# EasyEDA Pro project 搞机小队_v1.1.3.eprj, schematic 机身
Board Name: 机身; Create Date: 2025-09-06; Page Name: P1; Project Name: 搞机小队_v1.1.3; Schematic Name: 机身; Update Date: 2025-10-28; Company: 嘉立创EDA; Page Size: A4; Version: V1.0
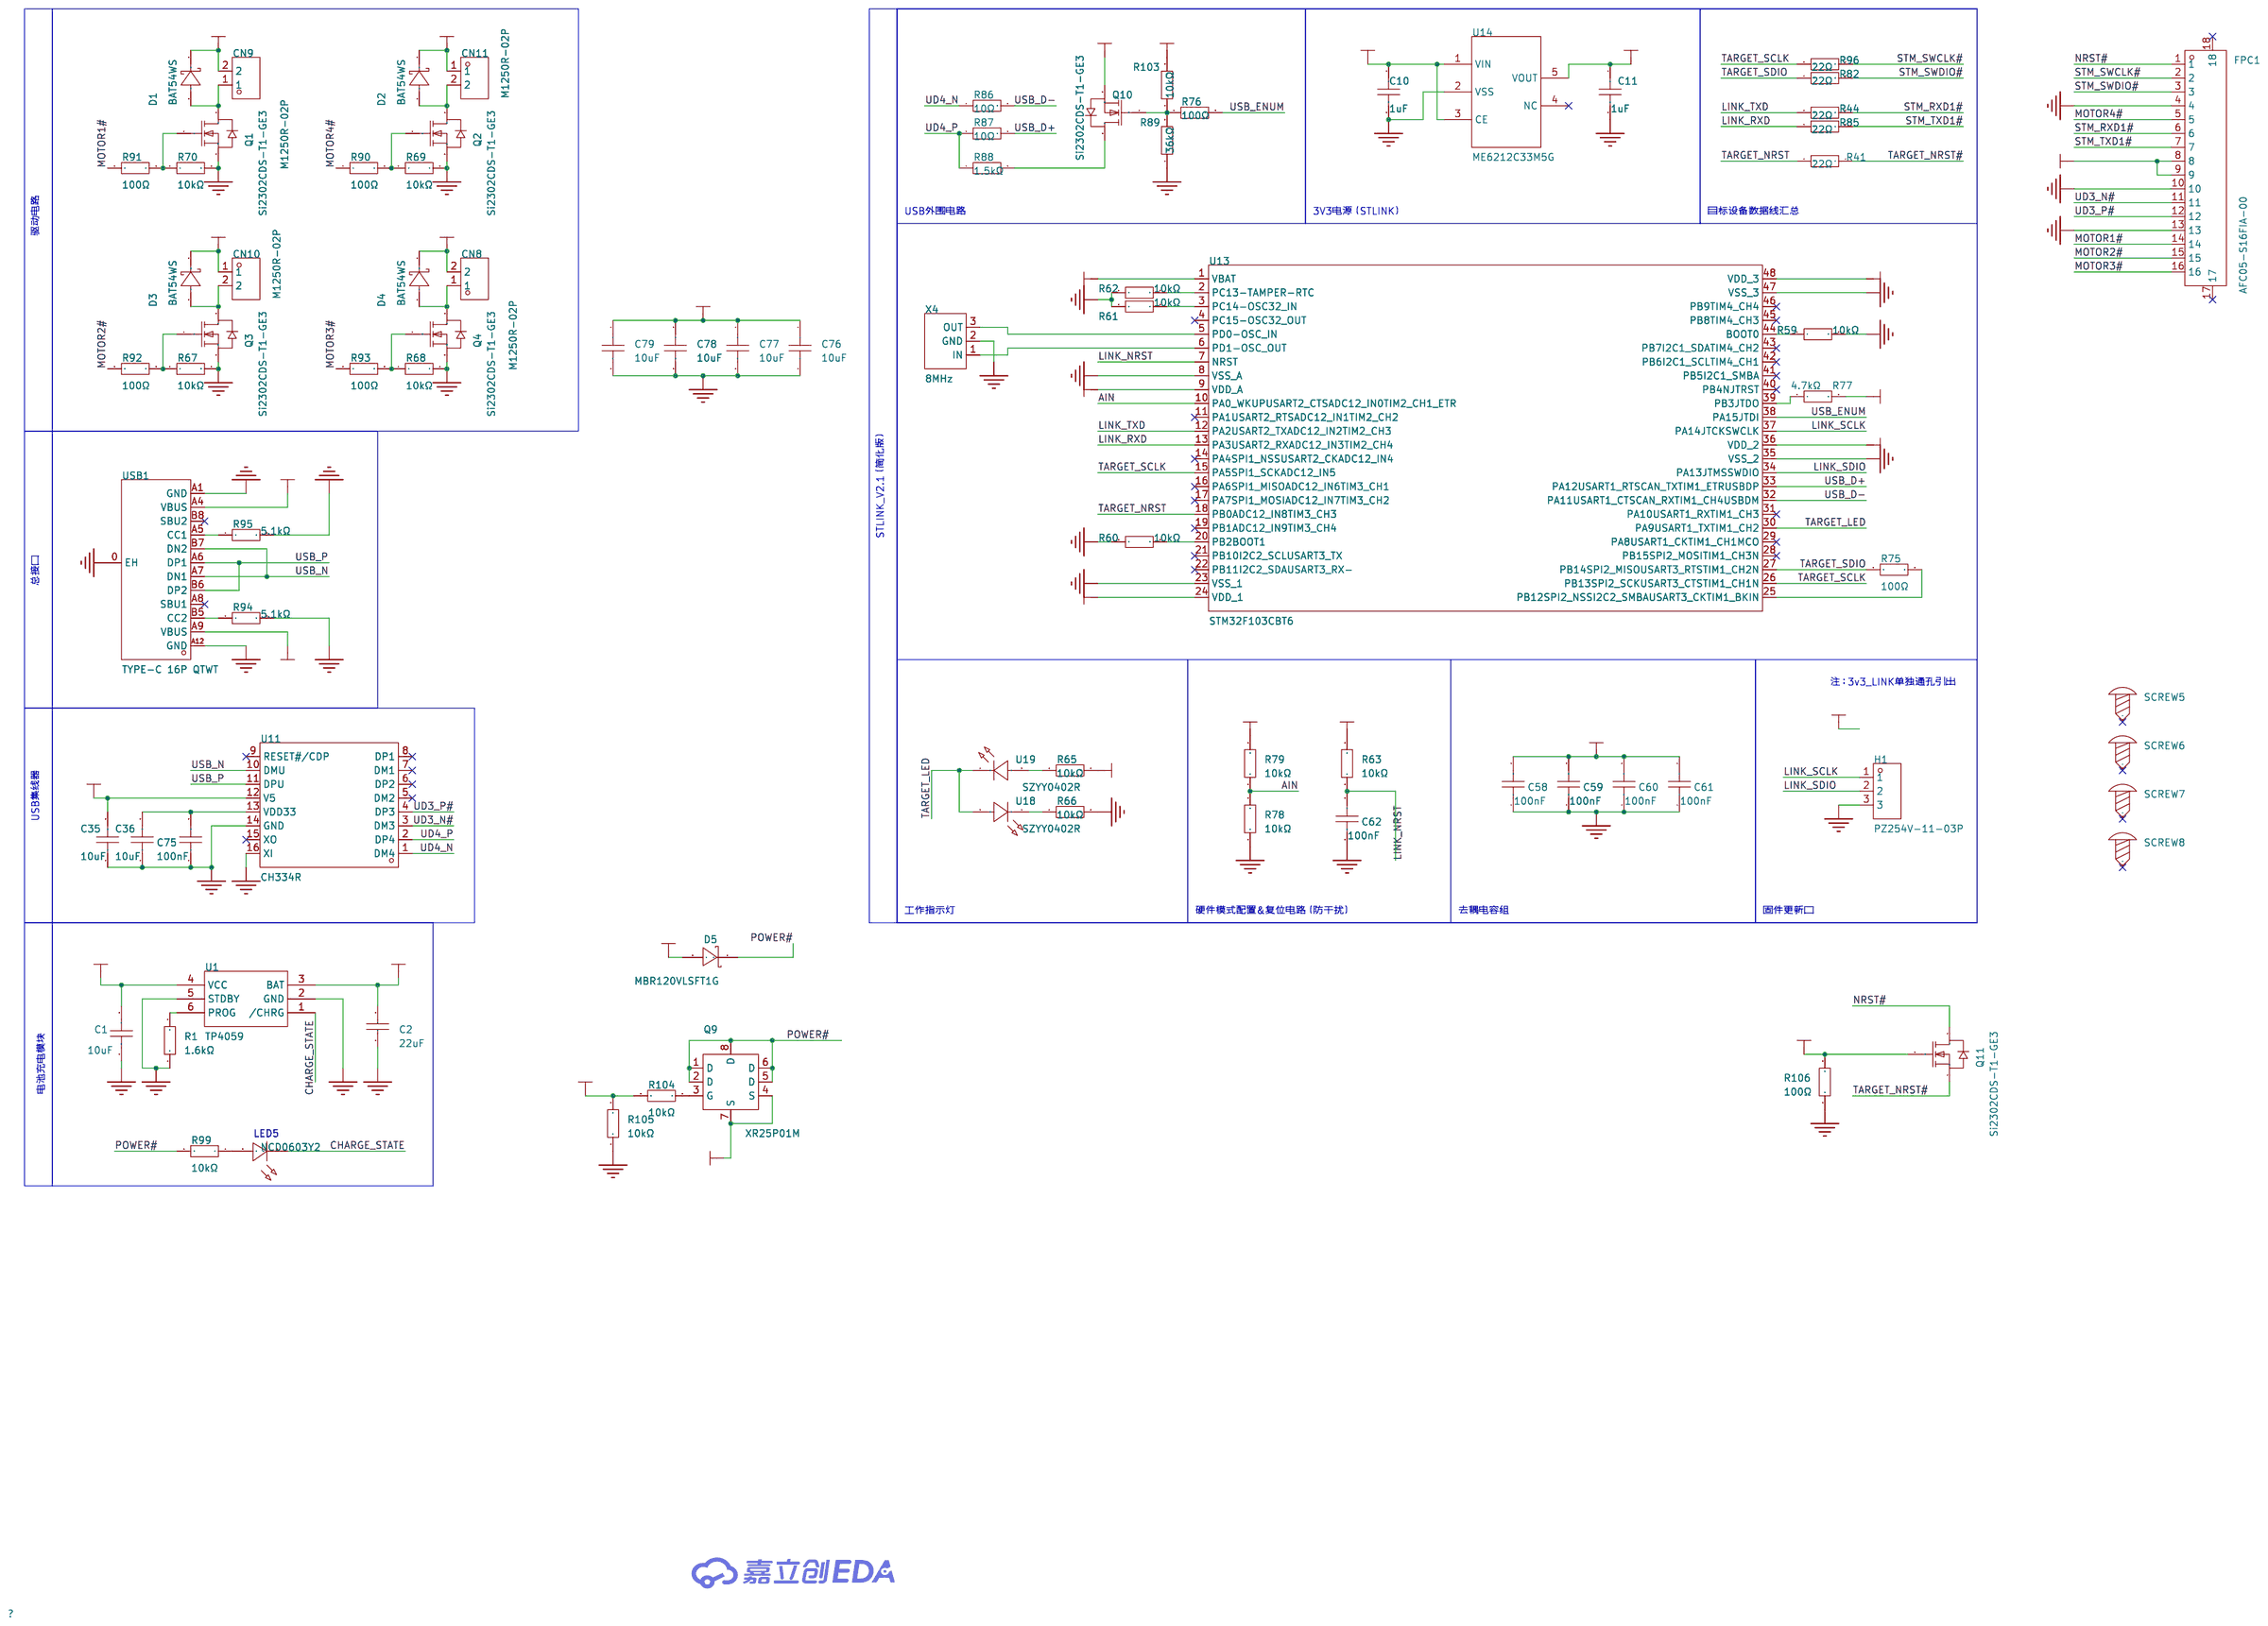
[diagram p1: schematic sheet]

## Parts
C1  10uF  [C0603]
C2  22uF  [C0603]
C10  1uF  [C0603]
C11  1uF  [C0603]
C35  10uF  [C0603]
C36  10uF  [C0603]
C58  100nF  [C0402]
C59  100nF  [C0402]
C60  100nF  [C0402]
C61  100nF  [C0402]
C62  100nF  [C0402]
C75  100nF  [C0402]
C76  10uF  [C0805]
C77  10uF  [C0805]
C78  10uF  [C0805]
C79  10uF  [C0805]
CN8  M1250R-02P  [CONN-TH_2P-P1.25_L4.7-W4.3]
CN9  M1250R-02P  [CONN-TH_2P-P1.25_L4.7-W4.3]
CN10  M1250R-02P  [CONN-TH_2P-P1.25_L4.7-W4.3]
CN11  M1250R-02P  [CONN-TH_2P-P1.25_L4.7-W4.3]
D1  BAT54WS  [SOD-323_L1.7-W1.3-LS2.6-RD]
D2  BAT54WS  [SOD-323_L1.7-W1.3-LS2.6-RD]
D3  BAT54WS  [SOD-323_L1.7-W1.3-LS2.6-RD]
D4  BAT54WS  [SOD-323_L1.7-W1.3-LS2.6-RD]
D5  MBR120VLSFT1G  [SOD-123F_L2.8-W1.8-LS3.7-RD]
FPC1  AFC05-S16FIA-00  [FPC-SMD_16P-P0.50_AFC05-S16FIA-00]
H1  PZ254V-11-03P  [HDR-TH_3P-P2.54-V-M]
LED5  NCD0603Y2  [LED0603-RD]
Q1  Si2302CDS-T1-GE3  [SOT-23_L2.9-W1.3-P1.90-LS2.4-BR]
Q2  Si2302CDS-T1-GE3  [SOT-23_L2.9-W1.3-P1.90-LS2.4-BR]
Q3  Si2302CDS-T1-GE3  [SOT-23_L2.9-W1.3-P1.90-LS2.4-BR]
Q4  Si2302CDS-T1-GE3  [SOT-23_L2.9-W1.3-P1.90-LS2.4-BR]
Q9  XR25P01M  [DFN-6L_L2.0-W2.0-P0.65-BL]
Q10  Si2302CDS-T1-GE3  [SOT-23_L2.9-W1.3-P1.90-LS2.4-BR]
Q11  Si2302CDS-T1-GE3  [SOT-23_L2.9-W1.3-P1.90-LS2.4-BR]
R1  1.6kΩ  [R0402]
R41  22Ω  [R0603]
R44  22Ω  [R0603]
R59  10kΩ  [R0402]
R60  10kΩ  [R0402]
R61  10kΩ  [R0402]
R62  10kΩ  [R0402]
R63  10kΩ  [R0402]
R65  10kΩ  [R0402]
R66  10kΩ  [R0402]
R67  10kΩ  [R0402]
R68  10kΩ  [R0402]
R69  10kΩ  [R0402]
R70  10kΩ  [R0402]
R75  100Ω  [R0402]
R76  100Ω  [R0402]
R77  4.7kΩ  [R0402]
R78  10kΩ  [R0402]
R79  10kΩ  [R0402]
R82  22Ω  [R0402]
R85  22Ω  [R0402]
R86  10Ω  [R0402]
R87  10Ω  [R0402]
R88  1.5kΩ  [R0402]
R89  36kΩ  [R0402]
R90  100Ω  [R0402]
R91  100Ω  [R0402]
R92  100Ω  [R0402]
R93  100Ω  [R0402]
R94  5.1kΩ  [R0402]
R95  5.1kΩ  [R0402]
R96  22Ω  [R0603]
R99  10kΩ  [R0402]
R103  10kΩ  [R0805]
R104  10kΩ  [R0402]
R105  10kΩ  [R0402]
R106  100Ω  [R0402]
SCREW5  -  [M2螺丝]
SCREW6  -  [M2螺丝]
SCREW7  -  [M2螺丝]
SCREW8  -  [M2螺丝]
U1  TP4059  [SOT-23-6_L2.9-W1.6-P0.95-LS2.8-BR]
U11  CH334R  [QSOP-16_L4.9-W3.9-P0.64-LS6.0-BL]
U13  STM32F103CBT6  [LQFP-48_L7.0-W7.0-P0.50-LS9.0-BL]
U14  ME6212C33M5G  [SOT-23-5_L3.0-W1.7-P0.95-LS2.8-BL]
U18  SZYY0402R  [LED0402-RD_RED]
U19  SZYY0402R  [LED0402-RD_RED]
USB1  TYPE-C 16P QTWT  [USB-TYPE-C-SMD_TYPE-C-16P-QTWT]
X4  8MHz  [OSC-SMD_3P-L3.2-W1.3-P1.20]

## Library data of the parts
C1 C35 C36 = CC0603KRX5R6BB106: 容值:10uF;精度:±10%;额定电压:10V;材质(温度系数):X5R;; LCSC Part Name: 10uF ±10% 10V; Supplier Part: C326057; Manufacturer: YAGEO(国巨); Supplier Footprint: 0603; JLCPCB Part Class: 扩展库; Datasheet: https://atta.szlcsc.com/upload/public/pdf/source/20181031/C326057_4190003E428C5A97DF6434D0EAB53BEA.pdf; Supplier: LCSC; Tolerance: ±10%; Voltage Rated: 10V; Temperature Coefficient: X5R
C2 = CC0603MRX5R6BB226: 容值:22uF;精度:±20%;额定电压:10V;温度系数:X5R;; LCSC Part Name: 22uF ±20% 10V; Supplier Part: C109447; Manufacturer: YAGEO(国巨); Supplier Footprint: 0603; JLCPCB Part Class: Extended Part; Datasheet: https://item.szlcsc.com/datasheet/CC0603MRX5R6BB226/110668.html; Supplier: LCSC; Tolerance: ±20%; Voltage Rated: 10V; Temperature Coefficient: X5R; Voltage Rating: 10V
C10 C11 = CC0603KRX7R7BB105: LCSC Part Name: 1uF ±10% 16V; Supplier Part: C106248; Manufacturer: YAGEO(国巨); Supplier Footprint: 0603; JLCPCB Part Class: Extended Part; Datasheet: https://item.szlcsc.com/datasheet/CC0603KRX7R7BB105/107463.html; Supplier: LCSC; Tolerance: ±10%; Voltage Rating: 16V; Temperature Coefficient: X7R
C58-C62 C75 = CC0402KRX7R7BB104: 容值:100nF;精度:±10%;额定电压:16V;材质(温度系数):X7R;; LCSC Part Name: 100nF ±10% 16V; Supplier Part: C60474; Manufacturer: YAGEO(国巨); Supplier Footprint: 0402; Datasheet: https://atta.szlcsc.com/upload/public/pdf/source/20211223/9278FD768280B81DDBEF48FA36411A03.pdf; Supplier: LCSC; Tolerance: ±10%; Voltage Rated: 16V; Temperature Coefficient: X7R
C76-C79 = CC0805KKX7R6BB106: 容值:10uF;精度:±10%;额定电压:10V;温度系数:X7R;; LCSC Part Name: 10uF ±10% 10V; Supplier Part: C1952580; Manufacturer: YAGEO(国巨); Supplier Footprint: 0805; JLCPCB Part Class: 扩展库; Datasheet: https://item.szlcsc.com/datasheet/CC0805KKX7R6BB106/2044114.html; Supplier: LCSC; Tolerance: ±10%; Voltage Rating: 10V; Temperature Coefficient: X7R
CN8-CN11 = M1250R-02P: 插针结构:1x2P;间距:1.25mm;安装方式:弯插;参考系列:-;总PIN数:2P;排数:1;每排PIN数:2;行距:-;额定电流:1A;工作温度范围:-25℃~+85℃;; LCSC Part Name: 1x2P 间距:1.25mm 弯插; Supplier Part: C481436; Manufacturer: XFCN(兴飞); Supplier Footprint: 弯插,P=1.25mm; Datasheet: https://atta.szlcsc.com/upload/public/pdf/source/20200107/C481438_2614F4E1D71DF19BF060E3C7AF9821C4.pdf; Supplier: LCSC; Pins Structure: 1x2P; Pitch: 1.25mm; Mounting Style: 弯插; Number of Pins: 2P; Number of Rows: 1; Number of PINs Per Row: 2; Current Rating (Max): 1A; Operating Temperature Range: -25℃~+85℃
D1-D4 = BAT54WS_C5766570: 这款肖特基二极管具有0.2A的额定电流和30V的最大电压，其低正向压降仅为0.8V，在轻负载条件下反向电流低至2µA。该二极管能够承受高达0.6A的瞬态浪涌电流，适用于各种便携式电子产品中的高效整流或保护电路，确保设备稳定运行的同时减少能量损耗。(BAT54WS-7-F); LCSC Part Name: IF:0.2A VR:30V VF:0.8V IFSM:0.6A; Supplier Part: C5766570; Manufacturer: HXY MOSFET(华轩阳电子); Supplier Footprint: SOD-323; JLCPCB Part Class: 扩展库; Datasheet: https://atta.szlcsc.com/upload/public/pdf/source/20240930/6373992D0165080641439F83871EFB7A.pdf; Supplier: LCSC
D5 = MBR120VLSFT1G: 正向压降(Vf):300mV@1A;直流反向耐压(Vr):20V;整流电流:1A;; LCSC Part Name: 电压:20V 电流:1A; Supplier Part: C223608; Manufacturer: onsemi(安森美); Supplier Footprint: SOD-123FL; JLCPCB Part Class: 扩展库; Datasheet: https://item.szlcsc.com/datasheet/MBR120VLSFT1G/223798.html; Supplier: LCSC; Voltage - Forward(Vf@If): 300mV@1A; Voltage - DC Reverse(Vr): 20V; Current - Rectified: 1A; Reverse Leakage Current (Ir): 600uA@20V; Operating Junction Temperature Range: -65℃~+125℃; Non-Repetitive Peak Forward Surge Current: 45A
FPC1 = AFC05-S16FIA-00: 锁定特性:翻盖式;触点类型:下接;触点数量:16P;间距:0.5mm;安装方式:卧贴;; LCSC Part Name: 间距:0.5mm P数:16P 翻盖式 下接; Supplier Part: C561388; Manufacturer: JS(钜硕电子); Supplier Footprint: SMD,P=0.5mm,卧贴; Datasheet: https://item.szlcsc.com/datasheet/AFC05-S16FIA-00/586775.html; Supplier: LCSC; Locking Feature: 翻盖式; Contact Type: 下接; Number of Contacts: 16P; Pitch: 0.5mm; Mounting Type: 卧贴; FFC, FCB Thickness: 0.3mm; Height Above Board: 1mm
H1 = PZ254V-11-03P: LCSC Part Name: 1x3P 间距:2.54mm 方针 直插; Supplier Part: C2937625; Manufacturer: XFCN(兴飞); Supplier Footprint: 插件,P=2.54mm; JLCPCB Part Class: Extended Part; Datasheet: https://item.szlcsc.com/datasheet/PZ254V-11-03P/3293280.html; Supplier: LCSC; Pin Structure: 1x3P; Pitch: 2.54mm; Circluar Pins/Square Pins: 方针; Mounting Type: 直插; Number of Rows: 单排; Number of Pins: 3P; Current Rating: 3A; Voltage Rating (Max): 250V; Length of Mating Pin: 6mm; Insulation Height: 2.5mm; Length of End Connection Pin: 3mm; Operating Temperature: -40℃~+105℃; Color: 黑色
LED5 = NCD0603Y2: Supplier Part: C89811; Manufacturer: 国星光电; Supplier Footprint: 0603; JLCPCB Part Class: Extended Part; Datasheet: https://atta.szlcsc.com/upload/public/pdf/source/20200820/C89811_7FE84B429B6BCA3E113B125EE1452576.pdf; Supplier: LCSC; Emitted Color: 黄色; Forward Voltage (VF): 1.6V~2.6V; Power Dissipation: 65mW; Forward Current: 20mA; Dominant Wavelength: 586nm~595nm; Lens Color: 无色透明透镜; Luminous Intensity: 100mcd~220mcd; Viewing Angle: 130°; Operating Temperature: -30℃~+85℃
Q1-Q4 Q10 Q11 = Si2302CDS-T1-GE3: 类型:1个N沟道;漏源电压(Vdss):20V;连续漏极电流(Id):2.9A;导通电阻(RDS(on)@Vgs,Id):57mΩ@4.5V,3.6A;功率(Pd):550mW;阈值电压(Vgs(th)@Id):850mV@250uA;; LCSC Part Name: 1个N沟道 耐压:20V 电流:2.9A; Supplier Part: C10488; Manufacturer: VISHAY(威世); Supplier Footprint: SOT-23; JLCPCB Part Class: 扩展库; Datasheet: https://atta.szlcsc.com/upload/public/pdf/source/20121215/1457706570095.pdf; Supplier: LCSC; Type: 1个N沟道; Drain Source Voltage (Vdss): 20V; Continuous Drain Current (Id): 2.9A; Drain Source On Resistance (RDS(on)@Vgs,Id): 57mΩ@4.5V,3.6A; Power Dissipation (Pd): 550mW; Gate Threshold Voltage (Vgs(th)@Id): 850mV@250uA; Total Gate Charge (Qg@Vgs): 3.5nC@4.5V; Input Capacitance (Ciss@Vds): 320pF@10V; Reverse Transfer Capacitance (Crss@Vds): 5pF@10V; Operating Temperature: -55℃~+150℃
Q9 = XR25P01M: LCSC Part Name: P沟道15V快速开关MOSFET; Supplier Part: C42456887; Manufacturer: XNRUSEMI(新锐); Supplier Footprint: DFN2020-6L; Datasheet: https://item.szlcsc.com/datasheet/XR25P01M/44527977.html; Supplier: LCSC; Number: 1个P沟道; Drain to Source Voltage: 15V; Current - Continuous Drain(Id): 25A; RDS(on): 9mΩ@4.5V; Pd - Power Dissipation: 18W; Gate Threshold Voltage (Vgs(th)): 1V@250uA; Gate Charge(Qg): 35nC@4.5V; Input Capacitance(Ciss): 2.8nF; Reverse Transfer Capacitance (Crss@Vds): 590pF; Operating Temperature: -55℃~+150℃; Type: P沟道; Output Capacitance(Coss): 690pF
R1 = 0402WGF1601TCE: 电阻类型:厚膜电阻;阻值:1.6kΩ;精度:±1%;功率:62.5mW;最大工作电压:50V;温度系数:±100ppm/℃;; LCSC Part Name: 1.6kΩ ±1% 62.5mW 厚膜电阻; Supplier Part: C4908; Manufacturer: UNI-ROYAL(厚声); Supplier Footprint: 0402; Datasheet: https://atta.szlcsc.com/upload/public/pdf/source/20200306/C422600_1E6D84923E4A46A82E41ADD87F860B5C.pdf; Supplier: LCSC; Type: 厚膜电阻; Tolerance: ±1%; Power(Watts): 62.5mW; Overload Voltage (Max): 50V; Temperature Coefficient: ±100ppm/℃; Operating Temperature Range: -55℃~+155℃
R41 R44 R96 = 0603WAF220JT5E: LCSC Part Name: 22Ω ±1% 100mW 厚膜电阻; Supplier Part: C23345; Manufacturer: UNI-ROYAL(厚声); Supplier Footprint: 0603; JLCPCB Part Class: Basic Part; Datasheet: https://atta.szlcsc.com/upload/public/pdf/source/20200306/C422600_1E6D84923E4A46A82E41ADD87F860B5C.pdf; Supplier: LCSC; Type: 厚膜电阻; Tolerance: ±1%; Power(Watts): 100mW; Overload Voltage (Max): 75V; Temperature Coefficient: ±100ppm/℃; Operating Temperature Range: -55℃~+155℃
R59-R63 R65-R70 R78 R79 R99 R104 R105 = 0402WGF1002TCE: 电阻类型:厚膜电阻;阻值:10kΩ;精度:±1%;功率:62.5mW;工作电压:50V;温度系数:±100ppm/℃;; LCSC Part Name: 10kΩ ±1% 62.5mW 厚膜电阻; Supplier Part: C25744; Manufacturer: UNI-ROYAL(厚声); Supplier Footprint: 0402; JLCPCB Part Class: 基础库; Datasheet: https://item.szlcsc.com/datasheet/0402WGF1002TCE/26487.html; Supplier: LCSC; Type: 厚膜电阻; Tolerance: ±1%; Power(Watts): 62.5mW; Voltage-Supply(Max): 50V; Temperature Coefficient: ±100ppm/℃; Operating Temperature: -55℃~+155℃
R75 R76 R90-R93 R106 = 0402WGF1000TCE: 电阻类型:厚膜电阻;阻值:100Ω;精度:±1%;功率:62.5mW;最大工作电压:50V;温度系数:±200ppm/℃;; LCSC Part Name: 100Ω ±1% 62.5mW 厚膜电阻; Supplier Part: C25076; Manufacturer: UNI-ROYAL(厚声); Supplier Footprint: 0402; JLCPCB Part Class: 基础库; Datasheet: https://atta.szlcsc.com/upload/public/pdf/source/20200306/C422600_1E6D84923E4A46A82E41ADD87F860B5C.pdf; Supplier: LCSC; Type: 厚膜电阻; Tolerance: ±1%; Power(Watts): 62.5mW; Overload Voltage (Max): 50V; Temperature Coefficient: ±200ppm/℃; Operating Temperature Range: -55℃~+155℃
R77 = 0402WGF4701TCE: 电阻类型:厚膜电阻;阻值:4.7kΩ;精度:±1%;功率:62.5mW;工作电压:50V;温度系数:±100ppm/℃;; LCSC Part Name: 4.7kΩ ±1% 62.5mW 厚膜电阻; Supplier Part: C25900; Manufacturer: UNI-ROYAL(厚声); Supplier Footprint: 0402; JLCPCB Part Class: 基础库; Datasheet: https://item.szlcsc.com/datasheet/0402WGF4701TCE/26643.html; Supplier: LCSC; Type: 厚膜电阻; Tolerance: ±1%; Power(Watts): 62.5mW; Voltage-Supply(Max): 50V; Temperature Coefficient: ±100ppm/℃; Operating Temperature: -55℃~+155℃
R82 R85 = 0402WGF220JTCE: 电阻类型:厚膜电阻;阻值:22Ω;精度:±1%;功率:62.5mW;最大工作电压:50V;温度系数:±100ppm/℃;; LCSC Part Name: 22Ω ±1% 62.5mW 厚膜电阻; Supplier Part: C25092; Manufacturer: UNI-ROYAL(厚声); Supplier Footprint: 0402; JLCPCB Part Class: 基础库; Datasheet: https://atta.szlcsc.com/upload/public/pdf/source/20200306/C422600_1E6D84923E4A46A82E41ADD87F860B5C.pdf; Supplier: LCSC; Type: 厚膜电阻; Tolerance: ±1%; Power(Watts): 62.5mW; Overload Voltage (Max): 50V; Temperature Coefficient: ±100ppm/℃; Operating Temperature Range: -55℃~+155℃
R86 R87 = 0402WGF100JTCE: 电阻类型:厚膜电阻;阻值:10Ω;精度:±1%;功率:62.5mW;最大工作电压:50V;温度系数:±200ppm/℃;; LCSC Part Name: 10Ω ±1% 62.5mW 厚膜电阻; Supplier Part: C25077; Manufacturer: UNI-ROYAL(厚声); Supplier Footprint: 0402; JLCPCB Part Class: 基础库; Datasheet: https://atta.szlcsc.com/upload/public/pdf/source/20200306/C422600_1E6D84923E4A46A82E41ADD87F860B5C.pdf; Supplier: LCSC; Type: 厚膜电阻; Tolerance: ±1%; Power(Watts): 62.5mW; Overload Voltage (Max): 50V; Temperature Coefficient: ±200ppm/℃; Operating Temperature Range: -55℃~+155℃
R88 = 0402WGF1501TCE: 电阻类型:厚膜电阻;阻值:1.5kΩ;精度:±1%;功率:62.5mW;最大工作电压:50V;温度系数:±100ppm/℃;; LCSC Part Name: 1.5kΩ ±1% 62.5mW 厚膜电阻; Supplier Part: C25867; Manufacturer: UNI-ROYAL(厚声); Supplier Footprint: 0402; Datasheet: https://atta.szlcsc.com/upload/public/pdf/source/20200306/C422600_1E6D84923E4A46A82E41ADD87F860B5C.pdf; Supplier: LCSC; Type: 厚膜电阻; Tolerance: ±1%; Power(Watts): 62.5mW; Overload Voltage (Max): 50V; Temperature Coefficient: ±100ppm/℃; Operating Temperature Range: -55℃~+155℃
R89 = 0402WGF3602TCE: 电阻类型:厚膜电阻;阻值:36kΩ;精度:±1%;功率:62.5mW;工作电压:50V;温度系数:±100ppm/℃;; LCSC Part Name: 36kΩ ±1% 62.5mW 厚膜电阻; Supplier Part: C43676; Manufacturer: UNI-ROYAL(厚声); Supplier Footprint: 0402; JLCPCB Part Class: 扩展库; Datasheet: https://item.szlcsc.com/datasheet/0402WGF3602TCE/44669.html; Supplier: LCSC; Type: 厚膜电阻; Tolerance: ±1%; Power(Watts): 62.5mW; Voltage-Supply(Max): 50V; Temperature Coefficient: ±100ppm/℃; Operating Temperature: -55℃~+155℃
R94 R95 = 0402WGF5101TCE: 电阻类型:厚膜电阻;阻值:5.1kΩ;精度:±1%;功率:62.5mW;工作电压:50V;温度系数:±100ppm/℃;; LCSC Part Name: 5.1kΩ ±1% 62.5mW 厚膜电阻; Supplier Part: C25905; Manufacturer: UNI-ROYAL(厚声); Supplier Footprint: 0402; Datasheet: https://item.szlcsc.com/datasheet/0402WGF5101TCE/26648.html; Supplier: LCSC; Type: 厚膜电阻; Tolerance: ±1%; Power(Watts): 62.5mW; Voltage-Supply(Max): 50V; Temperature Coefficient: ±100ppm/℃; Operating Temperature: -55℃~+155℃
R103 = 0805W8F1002T5E_C17414: 电阻类型:厚膜电阻;阻值:10kΩ;精度:±1%;功率:125mW;工作电压:150V;温度系数:±100ppm/℃;; LCSC Part Name: 10kΩ ±1% 125mW 厚膜电阻; Supplier Part: C17414; Manufacturer: UNI-ROYAL(厚声); Manufacturer Part: 0805W8F1002T5E; Supplier Footprint: 0805; JLCPCB Part Class: 基础库; Datasheet: https://item.szlcsc.com/datasheet/0805W8F1002T5E/18102.html; Supplier: LCSC; Type: 厚膜电阻; Tolerance: ±1%; Power(Watts): 125mW; Voltage-Supply(Max): 150V; Temperature Coefficient: ±100ppm/℃; Operating Temperature: -55℃~+155℃
SCREW5-SCREW8 = M2螺丝: Supplier Footprint: 插件; Check: false
U1 = TP4059: 600mA 线性锂电池充电IC; Supplier Part: C80364; Manufacturer: TOPPOWER(南京拓微); Supplier Footprint: SOT-23-6; JLCPCB Part Class: 扩展库; Datasheet: https://atta.szlcsc.com/upload/public/pdf/source/20161128/1480296095027.pdf; Supplier: LCSC
U11 = CH334R: CH334和CH335是符合USB2.0协议规范的4端口USBHUB控制器芯片，上行端口支持USB2.0高速和全速，下行端口支持USB2.0高速480Mbps、全速12Mbps和低速1.5Mbps。; Supplier Part: C4154405; Manufacturer: WCH(南京沁恒); Supplier Footprint: QSOP-16-150mil; JLCPCB Part Class: 扩展库; Datasheet: https://atta.szlcsc.com/upload/public/pdf/source/20240313/F70B229B132CE2CA6E618A7ACAF406E8.pdf; Supplier: LCSC; type: 集线器; Protocol: USB 2.0; Data Rate: 480Mbps; Supply Voltage: 5V；3.3V; Operating Temperature: -40℃~+85℃
U13 = STM32F103CBT6: CPU内核:ARM-M3;CPU最大主频:72MHz;应用领域:-;; LCSC Part Name: 主流增强型ARM Cortex-M3 MCU，具有128 KB Flash、72 MHz CPU、电机控制、USB和CAN; Supplier Part: C8304; Manufacturer: ST(意法半导体); Supplier Footprint: LQFP-48(7x7); JLCPCB Part Class: 扩展库; Datasheet: https://atta.szlcsc.com/upload/public/pdf/source/20150811/1457707344439.pdf; Supplier: LCSC; CPU Core: ARM-M3; CPU Maximum Speed: 72MHz; Program Storage Size: 128KB; Program Memory Type: FLASH; Number of I/O: 37; ADC (Bit): 12bit; Voltage - Supply: 2V~3.6V
U14 = ME6212C33M5G: 输出类型:固定;工作电压:6V;输出电压:3.3V;输出电流:350mA;电源纹波抑制比(PSRR):65dB@(1kHz)；57dB@(10kHz);输出极性:正极;; LCSC Part Name: 输入6V 输出3.3V 350mA; Supplier Part: C81233; Manufacturer: MICRONE(南京微盟); Supplier Footprint: SOT-23-5; JLCPCB Part Class: 扩展库; Datasheet: https://atta.szlcsc.com/upload/public/pdf/source/20160823/1471947542949.pdf; Supplier: LCSC; Output Type: 固定; Voltage - Supply: 6V; Output Voltage: 3.3V; Output Current: 350mA; Power Supply Rejection Ratio (PSRR): 65dB@(1kHz)；57dB@(10kHz); Voltage Dropout: 260mV@(200mA); Features: 低ESR；过流保护(OCP)；带使能; Output Configuration: 正极; Number of Outputs: 1
U18 U19 = SZYY0402R: 发光颜色:红色;功率:-;正向电流:10mA;主波长:618nm~621nm;二极管配置:-;透镜颜色:-;色温:-;发光角度:120°;载带方式:-;工作温度:-40℃~+85℃;; LCSC Part Name: 红灯; Supplier Part: C434445; Manufacturer: yongyu(永裕光电); Supplier Footprint: 0402; Datasheet: https://atta.szlcsc.com/upload/public/pdf/source/20210222/C434445_96E66FD4A97C10D47B0AAC5C38FE0263.pdf; Supplier: LCSC; Emitted Color: 红色; Forward Current: 10mA; Dominant Wavelength: 618nm~621nm; Viewing Angle: 120°; Operating Temperature: -40℃~+85℃
USB1 = TYPE-C 16P QTWT: 连接器类型:Type-C;标准:USB 3.1;公母:母;安装方式:卧贴;触点数量:16P;端口数量:1;额定电流 - 电源:3A;触头材质:-;触头镀层:-;工作温度范围:-25℃~+85℃;焊接温度(最大值):-;; LCSC Part Name: Type-C 母 卧贴; Supplier Part: C5187472; Manufacturer: SHOU HAN(首韩); Supplier Footprint: SMD; JLCPCB Part Class: 扩展库; Datasheet: https://atta.szlcsc.com/upload/public/pdf/source/20220929/9CA39B32C19F2C1116A695DA9353B6B2.pdf; Supplier: LCSC; Connector Type: Type-C; Standard: USB 3.1; Gender: 母; Mounting Style: 卧贴; Number of Contacts: 16P; Number of Ports: 1; Current Rating - Power (Max): 3A; Operating Temperature Range: -25℃~+85℃; Rated Voltage (Max): 5V; Connect-Disconnect Life: 1万次; Core Colour: 黑色
X4 = CSTNE8M00G520000R0: 频率:8MHz;内置负载电容:10pF;谐振阻抗:40Ω;; LCSC Part Name: 8MHz ±0.5% 内置负载电容:10pF; Supplier Part: C907975; Manufacturer: muRata(村田); Supplier Footprint: SMD3213-3P; JLCPCB Part Class: 扩展库; Datasheet: https://atta.szlcsc.com/upload/public/pdf/source/20201022/C907975_BE77A173E35C03920A12013DDB2B8858.pdf; Supplier: LCSC; Built-in Load Capacitance: 10pF; Resonant Impedance: 40Ω; Operating Temperature: -40℃~+85℃

## Nets
3V3_LINK: C11.1 C58.2 C59.2 C60.2 C61.2 Q10.2(S) R63.2 R65.2 R77.2 R79.2 U13.1(VBAT) U13.9(VDD_A) U13.24(VDD_1) U13.36(VDD_2) U13.48(VDD_3) U14.5(VOUT)
GND: C1.1 C2.1 C10.2 C11.2 C35.1 C36.1 C58.1 C59.1 C60.1 C61.1 C62.1 C75.1 C76.2 C77.2 C78.2 C79.2 FPC1.4 FPC1.10 FPC1.13 H1.3 Q1.2(S) Q2.2(S) Q3.2(S) Q4.2(S) R1.1 R59.2 R60.1 R61.1 R62.1 R66.2 R67.2 R68.2 R69.2 R70.2 R78.1 R89.1 R94.2 R95.2 R105.1 R106.1 U1.2(GND) U1.5(STDBY) U11.14(GND) U11.16(XI) U13.8(VSS_A) U13.23(VSS_1) U13.35(VSS_2) U13.47(VSS_3) U14.2(VSS) USB1.0(EH) USB1.A1(GND) USB1.A12(GND) X4.2(GND)
AIN: R78.2 R79.1 U13.10(PA0_WKUPUSART2_CTSADC12_IN0TIM2_CH1_ETR)
CHARGE_STATE: LED5.1(C) U1.1(/CHRG)
LINK_NRST: C62.2 R63.1 U13.7(NRST)
LINK_RXD: R85.1 U13.13(PA3USART2_RXADC12_IN3TIM2_CH4)
LINK_SCLK: H1.1 U13.37(PA14JTCKSWCLK)
LINK_SDIO: H1.2 U13.34(PA13JTMSSWDIO)
LINK_TXD: R44.2 U13.12(PA2USART2_TXADC12_IN2TIM2_CH3)
MOTOR1#: FPC1.14 R91.1
MOTOR2#: FPC1.15 R92.1
MOTOR3#: FPC1.16 R93.1
MOTOR4#: FPC1.5 R90.1
NRST#: FPC1.1 Q11.3(D)
POWER#: D5.1(K) FPC1.8 FPC1.9 Q9.1(D) Q9.2(D) Q9.5(D) Q9.6(D) Q9.8(D) R99.2
STM_RXD1#: FPC1.6 R44.1
STM_SWCLK#: FPC1.2 R96.1
STM_SWDIO#: FPC1.3 R82.2
STM_TXD1#: FPC1.7 R85.2
TARGET_LED: U13.30(PA9USART1_TXTIM1_CH2) U18.2(A) U19.1(K)
TARGET_NRST: R41.2 U13.18(PB0ADC12_IN8TIM3_CH3)
TARGET_NRST#: Q11.2(S) R41.1
TARGET_SCLK: R96.2 U13.15(PA5SPI1_SCKADC12_IN5) U13.26(PB13SPI2_SCKUSART3_CTSTIM1_CH1N)
TARGET_SDIO: R75.1 R82.1 U13.27(PB14SPI2_MISOUSART3_RTSTIM1_CH2N)
UD3_N#: FPC1.11 U11.3(DM3)
UD3_P#: FPC1.12 U11.4(DP3)
UD4_N: R86.1 U11.1(DM4)
UD4_P: R87.1 R88.1 U11.2(DP4)
USB_D+: R87.2 U13.33(PA12USART1_RTSCAN_TXTIM1_ETRUSBDP)
USB_D-: R86.2 U13.32(PA11USART1_CTSCAN_RXTIM1_CH4USBDM)
USB_ENUM: R76.2 U13.38(PA15JTDI)
USB_N: U11.10(DMU) USB1.A7(DN1) USB1.B7(DN2)
USB_P: U11.11(DPU) USB1.A6(DP1) USB1.B6(DP2)
V_BAT: C2.2 C76.1 C77.1 C78.1 C79.1 CN8.2 CN9.2 CN10.1 CN11.1 D1.1(C) D2.1(C) D3.1(C) D4.1(C) Q9.4(S) Q9.7(S) U1.3(BAT)
V_USB: C1.2 C10.1 C35.2 D5.2(A) R103.2 R104.2 R105.2 U1.4(VCC) U11.12(V5) U14.1(VIN) U14.3(CE) USB1.A9(VBUS)
V_USB_S: Q11.1(G) R106.2 USB1.A4(VBUS)
$1N7740: R1.2 U1.6(PROG)
$1N7744: Q3.1(G) R67.1 R92.2
$1N7745: CN10.2 D3.2(A) Q3.3(D)
$1N7748: CN8.1 D4.2(A) Q4.3(D)
$1N7749: Q4.1(G) R68.1 R93.2
$1N7758: Q1.1(G) R70.1 R91.2
$1N7759: CN9.1 D1.2(A) Q1.3(D)
$1N7762: Q2.1(G) R69.1 R90.2
$1N7764: CN11.2 D2.2(A) Q2.3(D)
$1N8298: R95.1 USB1.A5(CC1)
$1N8323: R94.1 USB1.B5(CC2)
$1N9080: C36.2 C75.2 U11.13(VDD33)
$1N14297: R62.2 U13.2(PC13-TAMPER-RTC)
$1N14298: R61.2 U13.3(PC14-OSC32_IN)
$1N14300: U13.5(PD0-OSC_IN) X4.3(OUT)
$1N14302: U13.6(PD1-OSC_OUT) X4.1(IN)
$1N14357: R75.2 U13.25(PB12SPI2_NSSI2C2_SMBAUSART3_CKTIM1_BKIN)
$1N14363: R59.1 U13.44(BOOT0)
$1N14365: R77.1 U13.39(PB3JTDO)
$1N53040: R60.2 U13.20(PB2BOOT1)
$1N53317: R66.1 U18.1(K)
$1N67321: R65.1 U19.2(A)
$1N110093: LED5.2(A) R99.1
$1N132481: Q9.3(G) R104.1
Net-(Q10-1): Q10.1(G) R76.1 R89.2 R103.1
Net-(Q10-3): Q10.3(D) R88.2

Not connected (* = marked no-connect by the designer): FPC1 17* 18*; SCREW5 1*; SCREW6 1*; SCREW7 1*; SCREW8 1*; U11 5(DM2)* 6(DP2)* 7(DM1)* 8(DP1)* 9(RESET#/CDP)* 15(XO)*; U13 4(PC15-OSC32_OUT)* 11(PA1USART2_RTSADC12_IN1TIM2_CH2)* 14(PA4SPI1_NSSUSART2_CKADC12_IN4)* 16(PA6SPI1_MISOADC12_IN6TIM3_CH1)* 17(PA7SPI1_MOSIADC12_IN7TIM3_CH2)* 19(PB1ADC12_IN9TIM3_CH4)* 21(PB10I2C2_SCLUSART3_TX)* 22(PB11I2C2_SDAUSART3_RX-)* 28(PB15SPI2_MOSITIM1_CH3N)* 29(PA8USART1_CKTIM1_CH1MCO)* 31(PA10USART1_RXTIM1_CH3)* 40(PB4NJTRST)* 41(PB5I2C1_SMBA)* 42(PB6I2C1_SCLTIM4_CH1)* 43(PB7I2C1_SDATIM4_CH2)* 45(PB8TIM4_CH3)* 46(PB9TIM4_CH4)*; U14 4(NC)*; USB1 A8(SBU1)* B8(SBU2)*

## Notes on the sheet
- 驱动电路
- USB外围电路
- 3V3电源（STLINK）
- 目标设备数据线汇总
- STLINK_V2.1（简化版）
- 总接口
- 注：3v3_LINK单独通孔引出
- USB集线器
- 工作指示灯
- 硬件模式配置&复位电路（防干扰）
- 去耦电容组
- 固件更新口
- 电池充电模块
